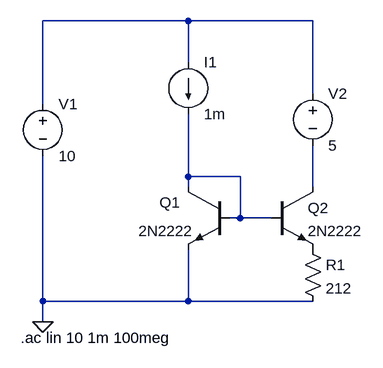
[diagram p0: schematic simu P1 Q9.asc]
simu P1 Q9.asc, the LTspice schematic file:
Version 4
SHEET 1 1240 680
WIRE 256 -128 32 -128
WIRE 448 -128 256 -128
WIRE 256 -64 256 -128
WIRE 448 -16 448 -128
WIRE 32 0 32 -128
WIRE 256 112 256 16
WIRE 336 112 256 112
WIRE 256 128 256 112
WIRE 448 128 448 64
WIRE 336 176 336 112
WIRE 336 176 320 176
WIRE 384 176 336 176
WIRE 32 304 32 80
WIRE 256 304 256 224
WIRE 256 304 32 304
WIRE 448 304 256 304
WIRE 32 336 32 304
FLAG 32 336 0
SYMBOL current 256 -64 R0
WINDOW 123 0 0 Left 0
WINDOW 39 0 0 Left 0
SYMATTR InstName I1
SYMATTR Value 1m
SYMBOL npn 320 128 M0
WINDOW 0 76 24 Left 2
SYMATTR InstName Q1
SYMATTR Value 2N2222
SYMBOL npn 384 128 R0
SYMATTR InstName Q2
SYMATTR Value 2N2222
SYMBOL voltage 32 -16 R0
WINDOW 123 0 0 Left 0
WINDOW 39 0 0 Left 0
SYMATTR InstName V1
SYMATTR Value 10
SYMBOL voltage 448 -32 R0
WINDOW 123 0 0 Left 0
WINDOW 39 0 0 Left 0
SYMATTR InstName V2
SYMATTR Value 5
SYMBOL res 432 208 R0
SYMATTR InstName R1
SYMATTR Value 212
TEXT -2 360 Left 2 !.ac lin 10 1m 100meg

The netlist it stands for:
* simu P1 Q9.asc
I1 N001 N002 1m
Q1 N002 N002 0 0 2N2222
Q2 N003 N002 P001 0 2N2222
V1 N001 0 10
V2 N001 N003 5
R1 P001 0 212
.model NPN NPN
.model PNP PNP
.lib standard.bjt
.ac lin 10 1m 100meg
.backanno
.end